# Altium project LimeSDR-X3_1v1.PrjPcb (part 13 of 19)

## Sheet 26_LMS3_RX2_BB_ADC.SchDoc: LMS3 RX2 BB ADC
size A3; Organization: Lime Microsystems; Address1: Surrey Tech Centre; Address2: Guildford GU2 7YG; Address3: Surrey; Address4: United Kingdom; Revision: v1.1; SheetNumber: 26; SheetTotal: 31
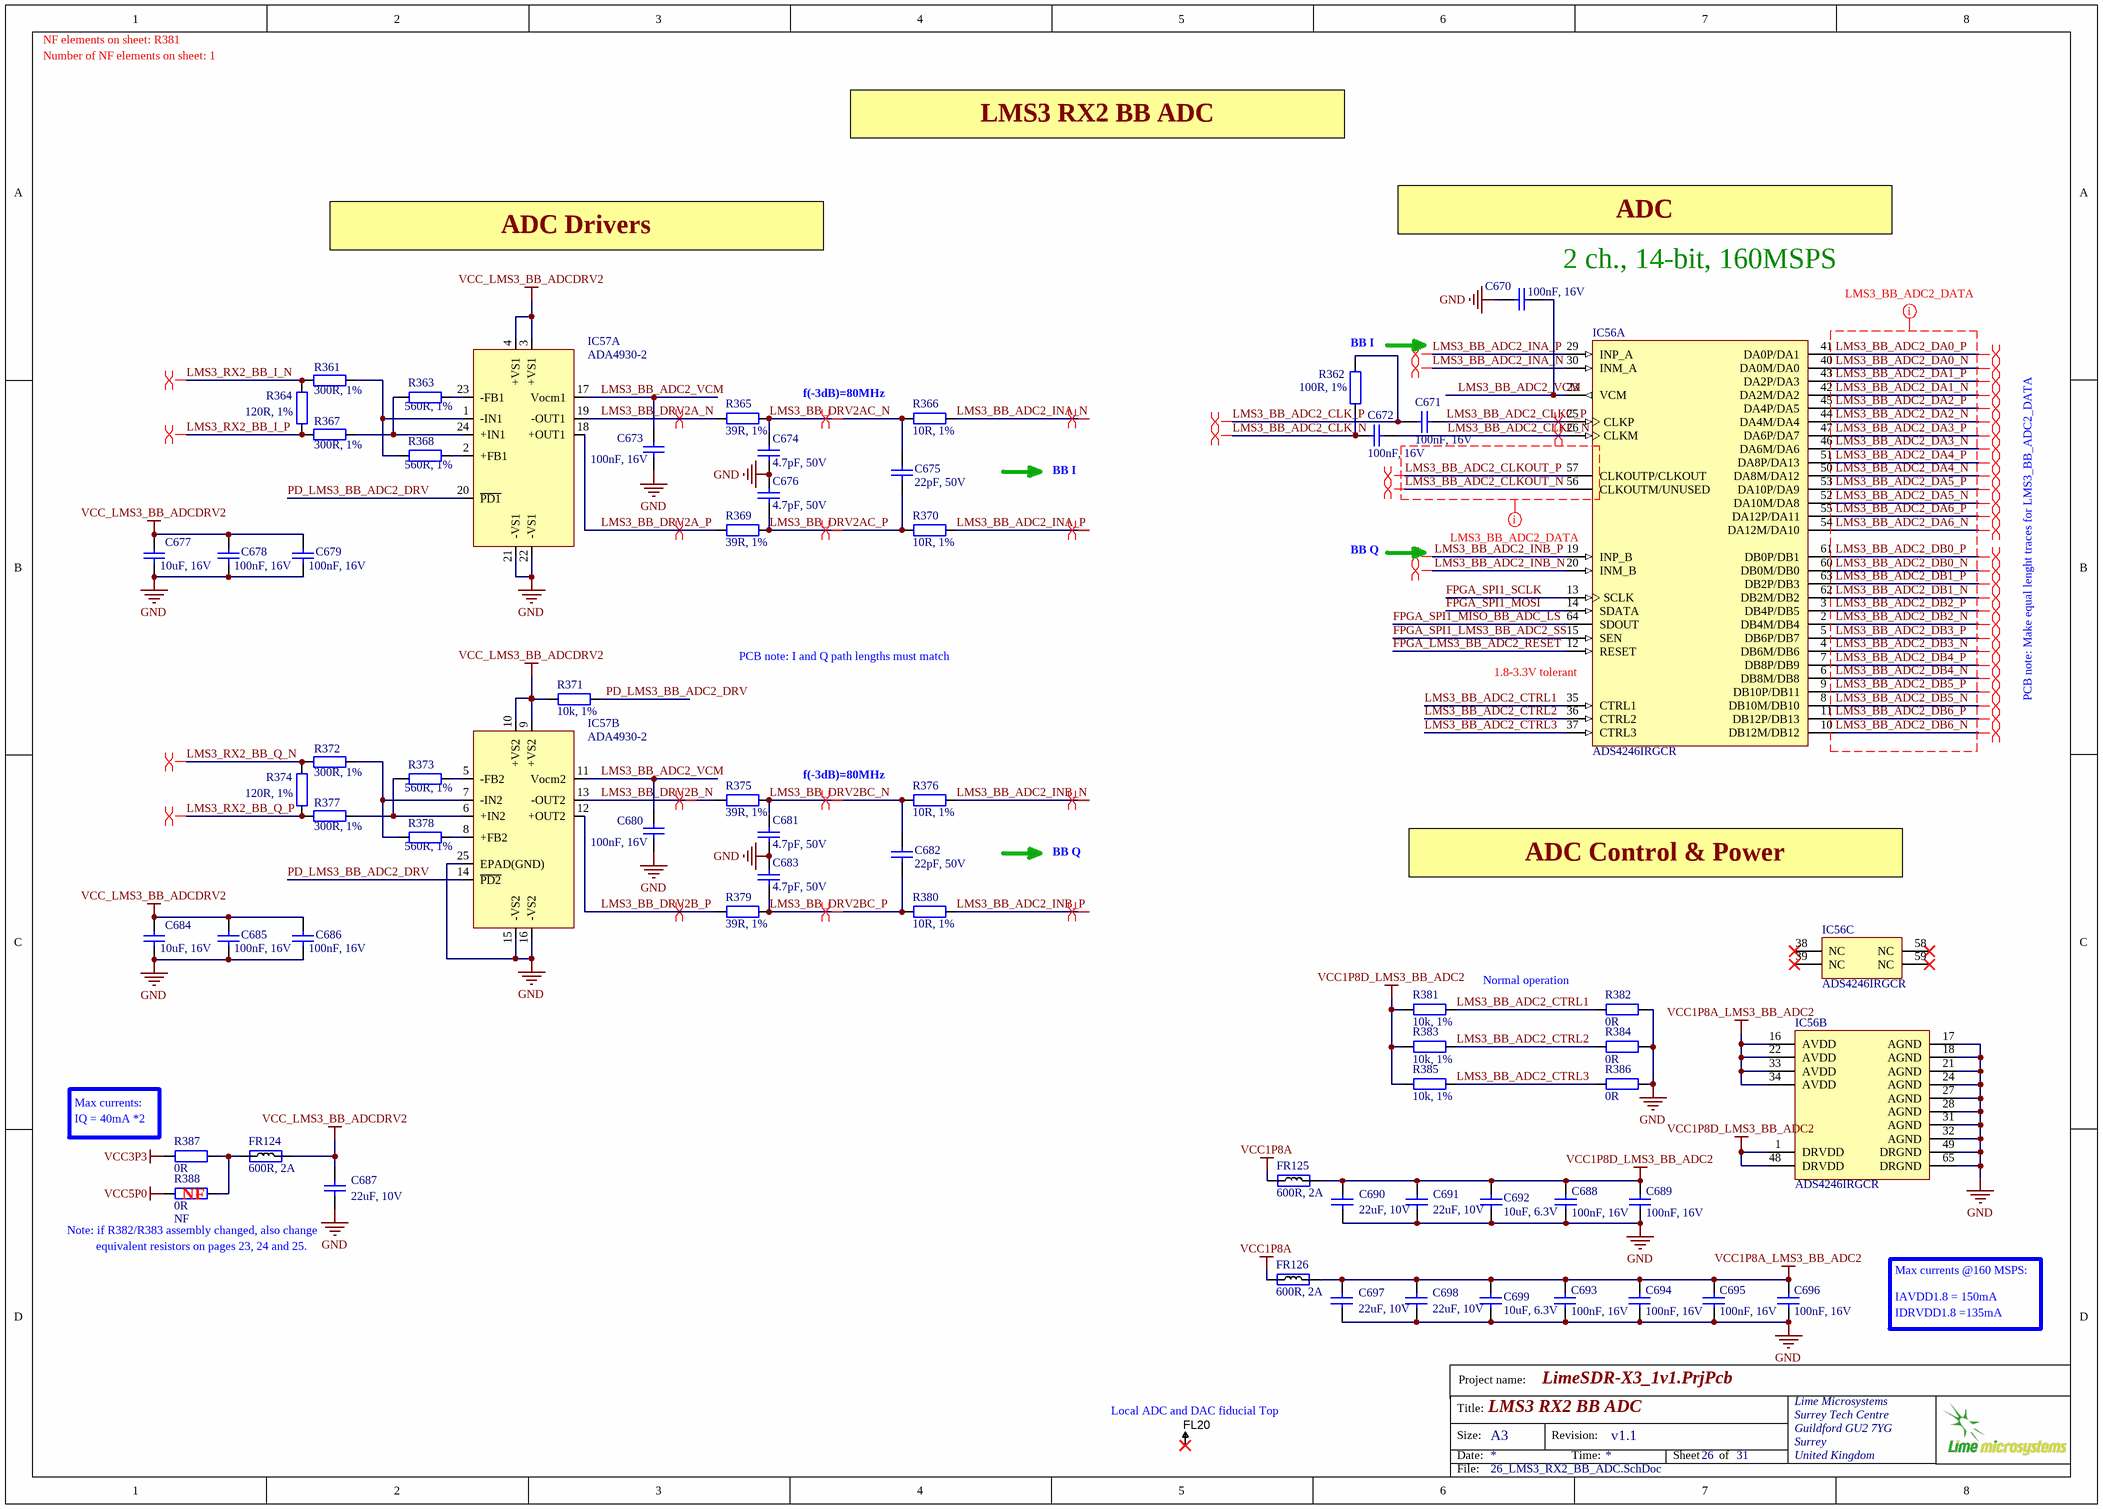
[diagram p25: 26_LMS3_RX2_BB_ADC.SchDoc]

### Parts
C670  100nF, 16V  [CAP0402]
C671  100nF, 16V  [CAP0402]
C672  100nF, 16V  [CAP0402]
C673  100nF, 16V  [CAP0402]
C674  4.7pF, 50V  [CAP0402]
C675  22pF, 50V  [CAP0402]
C676  4.7pF, 50V  [CAP0402]
C677  10uF, 16V  [CAP0603]
C678  100nF, 16V  [CAP0402]
C679  100nF, 16V  [CAP0402]
C680  100nF, 16V  [CAP0402]
C681  4.7pF, 50V  [CAP0402]
C682  22pF, 50V  [CAP0402]
C683  4.7pF, 50V  [CAP0402]
C684  10uF, 16V  [CAP0603]
C685  100nF, 16V  [CAP0402]
C686  100nF, 16V  [CAP0402]
C687  22uF, 10V  [CAP0603]
C688  100nF, 16V  [CAP0402]
C689  100nF, 16V  [CAP0402]
C690  22uF, 10V  [CAP0603]
C691  22uF, 10V  [CAP0603]
C692  10uF, 6.3V  [CAP0603]
C693  100nF, 16V  [CAP0402]
C694  100nF, 16V  [CAP0402]
C695  100nF, 16V  [CAP0402]
C696  100nF, 16V  [CAP0402]
C697  22uF, 10V  [CAP0603]
C698  22uF, 10V  [CAP0603]
C699  10uF, 6.3V  [CAP0603]
FL20  Fiducial  [Fiducial_local]  (value not drawn)
FR124  600R, 2A  [RES0805]
FR125  600R, 2A  [RES0805]
FR126  600R, 2A  [RES0805]
IC56  ADS4246IRGCR  [TI-RGC64-7400X7400TP_V]  (parts A,B,C of 3)
IC57  ADA4930-2  [ADA4930-2_LFCSP-24]  (parts A,B of 2)
R361  300R, 1%  [RES0402]
R362  100R, 1%  [RES0402]
R363  560R, 1%  [RES0402]
R364  120R, 1%  [RES0402]
R365  39R, 1%  [RES0402]
R366  10R, 1%  [RES0402]
R367  300R, 1%  [RES0402]
R368  560R, 1%  [RES0402]
R369  39R, 1%  [RES0402]
R370  10R, 1%  [RES0402]
R371  10k, 1%  [RES0402]
R372  300R, 1%  [RES0402]
R373  560R, 1%  [RES0402]
R374  120R, 1%  [RES0402]
R375  39R, 1%  [RES0402]
R376  10R, 1%  [RES0402]
R377  300R, 1%  [RES0402]
R378  560R, 1%  [RES0402]
R379  39R, 1%  [RES0402]
R380  10R, 1%  [RES0402]
R381  10k, 1%  [RES0402]
R382  0R  [RES0402]
R383  10k, 1%  [RES0402]
R384  0R  [RES0402]
R385  10k, 1%  [RES0402]
R386  0R  [RES0402]
R387  0R  [RES0402]
R388  0R  Assembly Info: NF  [RES0402]

### Nets
GND: C670.1 C673.2 C674.2 C676.1 C677.1 C678.2 C679.2 C680.2 C681.2 C683.1 C684.1 C685.2 C686.2 C687.1 C688.1 C689.1 C690.1 C691.1 C692.2 C693.1 C694.1 C695.1 C696.1 C697.1 C698.1 C699.2 IC56.17(AGND) IC56.18(AGND) IC56.21(AGND) IC56.24(AGND) IC56.27(AGND) IC56.28(AGND) IC56.31(AGND) IC56.32(AGND) IC56.49(DRGND) IC56.65(DRGND) IC57.15(-VS2) IC57.16(-VS2) IC57.21(-VS1) IC57.22(-VS1) IC57.25(EPAD(GND)) R382.1 R384.1 R386.1
VCC1P8A: FR125.1 FR126.1
VCC1P8A_LMS3_BB_ADC2: C693.2 C694.2 C695.2 C696.2 C697.2 C698.2 C699.1 FR126.2 IC56.16(AVDD) IC56.22(AVDD) IC56.33(AVDD) IC56.34(AVDD)
VCC1P8D_LMS3_BB_ADC2: C688.2 C689.2 C690.2 C691.2 C692.1 FR125.2 IC56.1(DRVDD) IC56.48(DRVDD) R381.2 R383.2 R385.2
VCC3P3: R387.2
VCC5P0: R388.2
VCC_LMS3_BB_ADCDRV2: C677.2 C678.1 C679.1 C684.2 C685.1 C686.1 C687.2 FR124.2 IC57.3(+VS1) IC57.4(+VS1) IC57.9(+VS2) IC57.10(+VS2) R371.2
FPGA_LMS3_BB_ADC2_RESET: IC56.12(RESET)
FPGA_SPI1_LMS3_BB_ADC2_SS: IC56.15(SEN)
FPGA_SPI1_MISO_BB_ADC_LS: IC56.64(SDOUT)
FPGA_SPI1_MOSI: IC56.14(SDATA)
FPGA_SPI1_SCLK: IC56.13(SCLK)
LMS3_BB_ADC2_CLK_N: C672.2 R362.1
LMS3_BB_ADC2_CLK_P: C671.2 R362.2
LMS3_BB_ADC2_CLKC_N: C672.1 IC56.26(CLKM)
LMS3_BB_ADC2_CLKC_P: C671.1 IC56.25(CLKP)
LMS3_BB_ADC2_CLKOUT_N: IC56.56(CLKOUTM/UNUSED)
LMS3_BB_ADC2_CLKOUT_P: IC56.57(CLKOUTP/CLKOUT)
LMS3_BB_ADC2_CTRL1: IC56.35(CTRL1) R381.1 R382.2
LMS3_BB_ADC2_CTRL2: IC56.36(CTRL2) R383.1 R384.2
LMS3_BB_ADC2_CTRL3: IC56.37(CTRL3) R385.1 R386.2
LMS3_BB_ADC2_DA0_N: IC56.40(DA0M/DA0)
LMS3_BB_ADC2_DA0_P: IC56.41(DA0P/DA1)
LMS3_BB_ADC2_DA1_N: IC56.42(DA2M/DA2)
LMS3_BB_ADC2_DA1_P: IC56.43(DA2P/DA3)
LMS3_BB_ADC2_DA2_N: IC56.44(DA4M/DA4)
LMS3_BB_ADC2_DA2_P: IC56.45(DA4P/DA5)
LMS3_BB_ADC2_DA3_N: IC56.46(DA6M/DA6)
LMS3_BB_ADC2_DA3_P: IC56.47(DA6P/DA7)
LMS3_BB_ADC2_DA4_N: IC56.50(DA8M/DA12)
LMS3_BB_ADC2_DA4_P: IC56.51(DA8P/DA13)
LMS3_BB_ADC2_DA5_N: IC56.52(DA10M/DA8)
LMS3_BB_ADC2_DA5_P: IC56.53(DA10P/DA9)
LMS3_BB_ADC2_DA6_N: IC56.54(DA12M/DA10)
LMS3_BB_ADC2_DA6_P: IC56.55(DA12P/DA11)
LMS3_BB_ADC2_DB0_N: IC56.60(DB0M/DB0)
LMS3_BB_ADC2_DB0_P: IC56.61(DB0P/DB1)
LMS3_BB_ADC2_DB1_N: IC56.62(DB2M/DB2)
LMS3_BB_ADC2_DB1_P: IC56.63(DB2P/DB3)
LMS3_BB_ADC2_DB2_N: IC56.2(DB4M/DB4)
LMS3_BB_ADC2_DB2_P: IC56.3(DB4P/DB5)
LMS3_BB_ADC2_DB3_N: IC56.4(DB6M/DB6)
LMS3_BB_ADC2_DB3_P: IC56.5(DB6P/DB7)
LMS3_BB_ADC2_DB4_N: IC56.6(DB8M/DB8)
LMS3_BB_ADC2_DB4_P: IC56.7(DB8P/DB9)
LMS3_BB_ADC2_DB5_N: IC56.8(DB10M/DB10)
LMS3_BB_ADC2_DB5_P: IC56.9(DB10P/DB11)
LMS3_BB_ADC2_DB6_N: IC56.10(DB12M/DB12)
LMS3_BB_ADC2_DB6_P: IC56.11(DB12P/DB13)
LMS3_BB_ADC2_INA_N: IC56.30(INM_A) R366.1
LMS3_BB_ADC2_INA_P: IC56.29(INP_A) R370.1
LMS3_BB_ADC2_INB_N: IC56.20(INM_B) R376.1
LMS3_BB_ADC2_INB_P: IC56.19(INP_B) R380.1
LMS3_BB_ADC2_VCM: C670.2 C673.1 C680.1 IC56.23(VCM) IC57.11(Vocm2) IC57.17(Vocm1)
LMS3_BB_DRV2A_N: IC57.19(-OUT1) R365.2
LMS3_BB_DRV2A_P: IC57.18(+OUT1) R369.2
LMS3_BB_DRV2AC_N: C674.1 C675.1 R365.1 R366.2
LMS3_BB_DRV2AC_P: C675.2 C676.2 R369.1 R370.2
LMS3_BB_DRV2B_N: IC57.13(-OUT2) R375.2
LMS3_BB_DRV2B_P: IC57.12(+OUT2) R379.2
LMS3_BB_DRV2BC_N: C681.1 C682.1 R375.1 R376.2
LMS3_BB_DRV2BC_P: C682.2 C683.2 R379.1 R380.2
LMS3_RX2_BB_I_N: R361.2 R364.2
LMS3_RX2_BB_I_P: R364.1 R367.2
LMS3_RX2_BB_Q_N: R372.2 R374.2
LMS3_RX2_BB_Q_P: R374.1 R377.2
PD_LMS3_BB_ADC2_DRV: IC57.14(~{PD2}) IC57.20(~{PD1}) R371.1
NetFR124_1: FR124.1 R387.1 R388.1
NetIC57_1: IC57.1(-IN1) R361.1 R368.2
NetIC57_2: IC57.2(+FB1) R368.1
NetIC57_5: IC57.5(-FB2) R373.1
NetIC57_6: IC57.6(+IN2) R373.2 R377.1
NetIC57_7: IC57.7(-IN2) R372.1 R378.2
NetIC57_8: IC57.8(+FB2) R378.1
NetIC57_23: IC57.23(-FB1) R363.1
NetIC57_24: IC57.24(+IN1) R363.2 R367.1

Not connected (* = marked no-connect by the designer): FL20 1*; IC56 38(NC)* 39(NC)* 58(NC)* 59(NC)*

### Layout directives
net class LMS3_BB_ADC2_DATA: LMS3_BB_ADC2_CLKOUT_N, LMS3_BB_ADC2_CLKOUT_P, LMS3_BB_ADC2_DA0_N, LMS3_BB_ADC2_DA0_P, LMS3_BB_ADC2_DA1_N, LMS3_BB_ADC2_DA1_P, LMS3_BB_ADC2_DA2_N, LMS3_BB_ADC2_DA2_P, LMS3_BB_ADC2_DA3_N, LMS3_BB_ADC2_DA3_P, LMS3_BB_ADC2_DA4_N, LMS3_BB_ADC2_DA4_P, LMS3_BB_ADC2_DA5_N, LMS3_BB_ADC2_DA5_P, LMS3_BB_ADC2_DA6_N, LMS3_BB_ADC2_DA6_P, LMS3_BB_ADC2_DB0_N, LMS3_BB_ADC2_DB0_P, LMS3_BB_ADC2_DB1_N, LMS3_BB_ADC2_DB1_P, LMS3_BB_ADC2_DB2_N, LMS3_BB_ADC2_DB2_P, LMS3_BB_ADC2_DB3_N, LMS3_BB_ADC2_DB3_P, LMS3_BB_ADC2_DB4_N, LMS3_BB_ADC2_DB4_P, LMS3_BB_ADC2_DB5_N, LMS3_BB_ADC2_DB5_P, LMS3_BB_ADC2_DB6_N, LMS3_BB_ADC2_DB6_P
differential pair: LMS3_BB_ADC2_CLK_N, LMS3_BB_ADC2_CLK_P, LMS3_BB_ADC2_CLKC_N, LMS3_BB_ADC2_CLKC_P, LMS3_BB_ADC2_CLKOUT_N, LMS3_BB_ADC2_CLKOUT_P, LMS3_BB_ADC2_DA0_N, LMS3_BB_ADC2_DA0_P, LMS3_BB_ADC2_DA1_N, LMS3_BB_ADC2_DA1_P, LMS3_BB_ADC2_DA2_N, LMS3_BB_ADC2_DA2_P, LMS3_BB_ADC2_DA3_N, LMS3_BB_ADC2_DA3_P, LMS3_BB_ADC2_DA4_N, LMS3_BB_ADC2_DA4_P, LMS3_BB_ADC2_DA5_N, LMS3_BB_ADC2_DA5_P, LMS3_BB_ADC2_DA6_N, LMS3_BB_ADC2_DA6_P, LMS3_BB_ADC2_DB0_N, LMS3_BB_ADC2_DB0_P, LMS3_BB_ADC2_DB1_N, LMS3_BB_ADC2_DB1_P, LMS3_BB_ADC2_DB2_N, LMS3_BB_ADC2_DB2_P, LMS3_BB_ADC2_DB3_N, LMS3_BB_ADC2_DB3_P, LMS3_BB_ADC2_DB4_N, LMS3_BB_ADC2_DB4_P, LMS3_BB_ADC2_DB5_N, LMS3_BB_ADC2_DB5_P, LMS3_BB_ADC2_DB6_N, LMS3_BB_ADC2_DB6_P, LMS3_BB_ADC2_INA_N, LMS3_BB_ADC2_INA_P, LMS3_BB_ADC2_INB_N, LMS3_BB_ADC2_INB_P, LMS3_BB_DRV2A_N, LMS3_BB_DRV2A_P, LMS3_BB_DRV2AC_N, LMS3_BB_DRV2AC_P, LMS3_BB_DRV2B_N, LMS3_BB_DRV2B_P, LMS3_BB_DRV2BC_N, LMS3_BB_DRV2BC_P, LMS3_RX2_BB_I_N, LMS3_RX2_BB_I_P, LMS3_RX2_BB_Q_N, LMS3_RX2_BB_Q_P

### Notes on the sheet
- NF elements on sheet: R381
- Number of NF elements on sheet: 1
- LMS3 RX2 BB ADC
- ADC Drivers
- ADC
- (near C670) 2 ch., 14-bit, 160MSPS
- (near R362) BB I
- f(-3dB)=80MHz
- BB I
- BB Q
- PCB note: I and Q path lengths must match
- (near IC56) 1.8-3.3V tolerant
- PCB note: Make equal lenght traces for LMS3_BB_ADC2_DATA
- ADC Control & Power
- Normal operation
- (near R387) IQ = 40mA *2
- (near R387) Max currents:
- Note: if R382/R383 assembly changed, also change
- equivalent resistors on pages 23, 24 and 25.
- (near R388) NF
- IAVDD1.8 = 150mA
- IDRVDD1.8 =135mA
- Max currents @160 MSPS:
- (near FL20) Local ADC and DAC fiducial Top
- Project name:
- Title:
- Size:
- Date:
- A3
- Revision:
- Time:
- Sheet
- of
- File:

### Library data of the parts
C670-C673 C680 C688 C689 C693-C696 = Cap_0603: Part Description: 0.10µF ±10% 16V X7R Ceramic Capacitor -55°C ~ 125°C Surface Mount, MLCC 0402 (1005 Metric) 0.039" L x 0.020" W (1.00mm x 0.50mm); Manufacturer Part Number 1: GRM155R71C104KA88D; Brand: Murata Electronics; Tolerance: 10 %; Type: General Purpose MLCC; Capacitance: 0.1 uF; Temperature Coefficient / Code: +/- 15 %; Case Height: 0.5 mm; Case Length: 1 mm; Dielectric: X7R; Supplier 1: Mouser; Supplier Part Number 1: 81-GRM155R71C104KA88; Case Code - in: 0402; Manufacturer: Murata Electronics; Category: Multilayer Ceramic Capacitors MLCC - SMD/SMT; Voltage Rating DC: 16 V; Value: 100nF, 16V; Case Code - mm: 1005; Case Width: 0.5 mm; Maximum Operating Temperature: + 125 C; Minimum Operating Temperature: - 55 C; Minimum Order Quantity: 1; Operating Temperature Range: - 55 C to + 125 C; Package / Case: 0402 (1005 metric); Packaging: Reel; Product: General Type MLCCs; Product Category: Low & Medium Capacitance SMD Ceramic Chip Capacitors; Reeling: True; RoHS - Mouser: Y; RoHS: RoHS Compliant; Series: GRM; Standard Pack Qty: 10000; Termination Style: SMD/SMT
C674 C676 C681 C683 = Cap_0402: Manufacturer: MURATA; Manufacturer Part Number 1: GRM1555C1H4R7CA01D; Part Description: 4.7pF ±0.25pF 50V Ceramic Capacitor C0G, NP0 0402 (1005 Metric); Capacitance Tolerance: ± 0.25; Voltage Rating: 50; Dielectric Characteristic: C0G / NP0; Ceramic Capacitor Case: 0402 [1005 Metric]; Capacitance: 4.7; SVHC: No SVHC (15-Jun-2015; Product Range: GRM Series; Value: 4.7pF, 50V; Supplier 1: Farnell; Supplier Part Number 1: 2434644; Operating Temperature Max: 125; Operating Temperature Min: -55; MSL: MSL 1 - Unlimited; RoHS: YES; Packaging: Cut Tape
C675 C682 = Cap_0402: Manufacturer: Yageo; Manufacturer Part Number 1: CC0402JRNPO9BN220; Part Description: 22pF ±5% 50V C0G, NP0 Ceramic Capacitor -55°C ~ 125°C Surface Mount, MLCC 0402 (1005 Metric) 0.039" L x 0.020" W (1.00mm x 0.50mm); Tolerance: ±5%; Temperature Coefficient: C0G, NP0; Value: 22pF, 50V; Supplier 1: Digi-Key; Supplier Part Number 1: 311-1018-2-ND; Category: Capacitors; Voltage - Rated: 50V; Packaging: Tape & Reel (TR); RoHS: RoHS Compliant; Capacitance: 22pF; Operating Temperature: -55°C ~ 125°C; Mounting Type: Surface Mount, MLCC; Height - Seated (Max): -; Size / Dimension: 0.039" L x 0.020" W (1.00mm x 0.50mm); Ratings: -; Applications: General Purpose; Thickness (Max): 0.022" (0.55mm); Lead Spacing: -; Lead Style: -; Features: -; Package / Case: 0402 (1005 Metric)
C677 C684 = Cap_0603: Manufacturer: Yageo; Manufacturer Part Number 1: GRM188R61C106MA73D; Part Description: 10µF ±20% 16V Ceramic Capacitor X5R 0603 (1608 Metric); Temperature Coefficient: X5R; Capacitance: 10µF; Tolerance: ±20%; Value: 10uF, 16V; Supplier 1: Digi-Key; Supplier Part Number 1: 490-7201-2-ND; Category: Capacitors; Ratings: -; Features: -; Lead Style: -; Package / Case: 0603 (1608 Metric); Lead Spacing: -; Applications: General Purpose; Voltage - Rated: 16V; Operating Temperature: -55°C ~ 85°C; Thickness (Max): 0.039" (1.00mm); Mounting Type: Surface Mount, MLCC; RoHS: RoHS Compliant; Size / Dimension: 0.063" L x 0.031" W (1.60mm x 0.80mm); Packaging: Tape & Reel (TR); Height - Seated (Max): -
C678 C679 C685 C686 = Cap_0603: Manufacturer Part Number 1: GRM155R71C104KA88D; Part Description: 0.10µF ±10% 16V X7R Ceramic Capacitor -55°C ~ 125°C Surface Mount, MLCC 0402 (1005 Metric) 0.039" L x 0.020" W (1.00mm x 0.50mm); Brand: Murata Electronics; Tolerance: 10 %; Type: General Purpose MLCC; Capacitance: 0.1 uF; Temperature Coefficient / Code: +/- 15 %; Case Height: 0.5 mm; Case Length: 1 mm; Dielectric: X7R; Supplier 1: Mouser; Supplier Part Number 1: 81-GRM155R71C104KA88; Case Code - in: 0402; Manufacturer: Murata Electronics; Category: Multilayer Ceramic Capacitors MLCC - SMD/SMT; Voltage Rating DC: 16 V; Value: 100nF, 16V; Case Code - mm: 1005; Case Width: 0.5 mm; Maximum Operating Temperature: + 125 C; Minimum Operating Temperature: - 55 C; Minimum Order Quantity: 1; Operating Temperature Range: - 55 C to + 125 C; Package / Case: 0402 (1005 metric); Packaging: Reel; Product: General Type MLCCs; Product Category: Low & Medium Capacitance SMD Ceramic Chip Capacitors; Reeling: True; RoHS - Mouser: Y; RoHS: RoHS Compliant; Series: GRM; Standard Pack Qty: 10000; Termination Style: SMD/SMT
C687 C690 C691 C697 C698 = Cap_0603: Manufacturer Part Number 1: C1608X5R1A226M080AC; Part Description: 22µF ±20% 10V Ceramic Capacitor X5R 0603 (1608 Metric); Manufacturer: TDK Corporation; Brand: TDK; Temperature Coefficient / Code: +/- 15 %; Tolerance: 20 %; Type: Multilayer Ceramic Chip Capacitor; Supplier 1: Mouser; Supplier Part Number 1: 810-C1608X5R1A226M; Package / Case: 0603 (1608 metric); Category: Multilayer Ceramic Capacitors MLCC - SMD/SMT; Capacitance: 22uF; Operating Temperature Range: - 55 C to + 85 C; Case Code - in: 0603; Voltage Rating DC: 10 V; Case Code - mm: 1608; Value: 22uF, 10V
C692 C699 = Cap_0603: Manufacturer Part Number 1: CC0603MRX5R5BB106; Part Description: 10µF ±20% 6.3V X5R Ceramic Capacitor -55°C ~ 85°C Surface Mount, MLCC 0603 (1608 Metric) 0.063" L x 0.031" W (1.60mm x 0.80mm); Manufacturer: Yageo; Capacitance: 10µF; Tolerance: ±20%; Supplier 1: Digi-Key; Supplier Part Number 1: 311-1448-2-ND; Package / Case: 0603 (1608 Metric); Category: Capacitors; Voltage - Rated: 6.3V; Value: 10uF, 6.3V
FR124 = Ferrite: Manufacturer Part Number 1: MPZ2012S601AT000; Manufacturer: TDK Corporation; Part Description: FERRITE BEAD 600 OHM 0805 1LN; Filter Type: Differential Mode - Single; Impedance @ Frequency: 600 Ohm @ 100MHz; DC Resistance (DCR): 100 mOhm Max; Supplier 1: Digi-Key; Supplier Part Number 1: 445-2206-2-ND; Mounting Type: Surface Mount; RoHS: RoHS Compliant; Height (Max): 0.041" (1.05mm); Packaging: Tape & Reel (TR); Category: Filters; Current Rating: 2A; Package / Case: 0805 (2012 Metric); Size / Dimension: 0.079" L x 0.049" W (2.00mm x 1.25mm); Value: 600R, 2A
FR125 FR126 = Ferrite: Manufacturer Part Number 1: MPZ2012S601AT000; Manufacturer: TDK Corporation; Part Description: FERRITE BEAD 600 OHM 0805 1LN; DC Resistance (DCR): 100 mOhm Max; Filter Type: Differential Mode - Single; Impedance @ Frequency: 600 Ohm @ 100MHz; Supplier 1: Digi-Key; Supplier Part Number 1: 445-2206-2-ND; Value: 600R, 2A; Category: Filters; Current Rating: 2A; Height (Max): 0.041" (1.05mm); Mounting Type: Surface Mount; Package / Case: 0805 (2012 Metric); Packaging: Tape & Reel (TR); RoHS: RoHS Compliant; Size / Dimension: 0.079" L x 0.049" W (2.00mm x 1.25mm)
IC56 = ADS4246IRGCR: 14-Bit 160 MSPS Dual Low Power ADC, -40 to 85 degC, 64-pin QFN (RGC64), Green (RoHS & no Sb/Br); Manufacturer: Texas Instruments; Manufacturer Part Number 1: ADS4246IRGCT; Part Description: 14 Bit Analog to Digital Converter 2 Input 2 Pipelined 64-VQFN (9x9); Number of Bits: 14; Sampling Rate (Per Second): 160M; Number of Inputs: 2; Input Type: Differential; Data Interface: LVDS - Parallel, Parallel; Configuration: S/H-ADC; Ratio - S/H:ADC: 1:1; Architecture: Pipelined; Reference Type: Internal; Voltage - Supply, Analog: 1.7 V ~ 1.9 V; Supplier 1: Digi-Key; Supplier Part Number 1: 296-28772-1-ND; RoHS: RoHS Compliant; Category: Integrated Circuits (ICs); Stock 1: 83; Pricing 1: 1=95.91, 10=90.96, 100=82.2967 (USD); Packaging: Cut Tape (CT); Part Status: Active; Number of A/D Converters: 2; Voltage - Supply, Digital: 1.7 V ~ 1.9 V; Features: Simultaneous Sampling; Operating Temperature: -40°C ~ 85°C; Package / Case: 64-VFQFN Exposed Pad; Supplier Device Package: 64-VQFN (9x9); ComponentLink1URL: http://www.ti.com/lit/ds/symlink/ads4246.pdf; ComponentLink1Description: http://www.ti.com/lit/ds/symlink/ads4246.pdf
IC57 = ADA4930-2: Manufacturer: Analog Devices Inc.; Manufacturer Part Number 1: ADA4930-2YCPZ-R7; Part Description: Differential Amplifier 2 Circuit Differential 24-LFCSP-WQ (4x4); Amplifier Type: Differential; Voltage - Supply, Single/Dual (±): 3.3V, 5V; Number of Circuits: 2; Current - Supply: 34mA; Slew Rate: 3400 V/µs; Voltage - Input Offset: 150µV; Current - Input Bias: 23µA; -3db Bandwidth: 1.35GHz; Current - Output / Channel: 30mA; Supplier 1: Digi-Key; Mounting Type: Surface Mount; Gain Bandwidth Product: -; Supplier Device Package: 24-LFCSP-VQ (4x4); Category: Integrated Circuits (ICs); Operating Temperature: -40°C ~ 105°C; Packaging: Cut Tape (CT); RoHS: RoHS Compliant; Package / Case: 24-VFQFN Exposed Pad, CSP; Output Type: Differential; Supplier Part Number 1: ADA4930-2YCPZ-R7CT-ND
R361 R367 R372 R377 = Res_0402: Manufacturer: Vishay Dale; Part Description: RES SMD 300 OHM 1% 1/16W 0402; Manufacturer Part Number 1: CRCW0402300RFKED; Resistance (Ohms): 300; Temperature Coefficient: ±100ppm/°C; Power (Watts): 0.063W, 1/16W; Value: 300R, 1%; Supplier 1: Digi-Key; Supplier Device Package: 0402 (1005 Metric); Composition: Thick Film; Features: Automotive AEC-Q200; Packaging: Cut Tape (CT); Size / Dimension: 0.039" L x 0.020" W (1.00mm x 0.50mm); Category: Resistors; Package / Case: 0402 (1005 Metric); Supplier Part Number 1: 541-300LCT-ND; Number of Terminations: 2; Tolerance: ±1%; Height: 0.016" (0.40mm); Operating Temperature: -55°C ~ 155°C; RoHS: RoHS Compliant
R362 = Res_0402: Manufacturer Part Number 1: RMCF0402FT100R; Part Description: RES SMD 100 OHM 1% 1/16W 0402; Manufacturer: Stackpole Electronics Inc.; Temperature Coefficient: ±100ppm/°C; Supplier 1: Digi-Key; Supplier Part Number 1: RMCF0402FT100RDKR-ND; Package / Case: 0402 (1005 Metric); Composition: Thick Film; Category: Resistors; Tolerance: ±1%; Value: 100R, 1%
R363 R368 R373 R378 = Res_0402: Manufacturer: Vishay Dale; Part Description: RES SMD 560 OHM 1% 1/16W 0402; Manufacturer Part Number 1: CRCW0402560RFKED; Resistance (Ohms): 560; Temperature Coefficient: ±100ppm/°C; Power (Watts): 0.063W, 1/16W; Value: 560R, 1%; Supplier Device Package: 0402 (1005 Metric); Composition: Thick Film; Packaging: Cut Tape (CT); Number of Terminations: 2; Operating Temperature: -55°C ~ 155°C; Supplier Part Number 1: 541-560LCT-ND; Supplier 1: Digi-Key; Category: Resistors; Height: 0.016" (0.40mm); Features: Automotive AEC-Q200; Size / Dimension: 0.039" L x 0.020" W (1.00mm x 0.50mm); Tolerance: ±1%; Package / Case: 0402 (1005 Metric); RoHS: RoHS Compliant
R364 R374 = Res_0402: Manufacturer: Yageo; Manufacturer Part Number 1: RC0402FR-07120RL; Part Description: 120 Ohms ±1% 0.063W, 1/16W Chip Resistor 0402 (1005 Metric) Moisture Resistant Thick Film; Power Rating: 62.5mW; Voltage Rating: 50V; Temperature Coefficient: 100ppm/°C; Max Power Dissipation: 63mW; Value: 120R, 1%; Supplier 1: Digi-Key; Supplier Part Number 1: 311-120LRCT-ND; Stock 1: 1593308; Pricing 1: 1=0.1, 10=0.016, 100=0.0067, 1000=0.00301, 2500=0.00261, 5000=0.00215 (USD); Case/Package: 0402; Case Code (Imperial): 0402; Case Code (Metric): 1005; Min Operating Temperature: -55°C; Max Operating Temperature: 155°C; Package Quantity: 1; Resistance: 120R; Tolerance: 1%; Packaging: Tape and Reel; Termination: SMD/SMT; Composition: Thick Film; Number of Terminations: 2; Military Standard: Not; Features: Moisture Resistant; Length: 1mm; Height: 0.016inch; Width: 0.02inch; Depth: 0.5mm; REACH SVHC: No SVHC; Lead Free: Lead Free; ComponentLink1URL: http://www.farnell.com/datasheets/1018594.pdf?src-supplier=Element14; ComponentLink1Description: http://www.farnell.com/datasheets/1018594.pdf?src-supplier=Element14; ComponentLink2URL: http://www.mouser.com/ds/2/447/PYu-RC0402_51_RoHS_L_6_r-8721.pdf?src-supplier=Mouser; ComponentLink2Description: http://www.mouser.com/ds/2/447/PYu-RC0402_51_RoHS_L_6_r-8721.pdf?src-supplier=Mouser; ComponentLink3URL: http://documents.rs-components.com/techlib://itc_doclist_GB.htm?stockno=6185898&src-supplier=RSComponents; ComponentLink3Description: http://documents.rs-components.com/techlib://itc_doclist_GB.htm?stockno=6185898&src-supplier=RSComponents; ComponentLink4URL: http://www.yageo.com/documents/recent/PYu-RC_Group_51_RoHS_L_10.pdf?src-supplier=Digi-Key; ComponentLink4Description: http://www.yageo.com/documents/recent/PYu-RC_Group_51_RoHS_L_10.pdf?src-supplier=Digi-Key; ComponentLink5URL: http://www.yageo.com/documents/recent/PYu-RC0402_51_RoHS_L_6_r.pdf?src-supplier=Future+Electronics; ComponentLink5Description: http://www.yageo.com/documents/recent/PYu-RC0402_51_RoHS_L_6_r.pdf?src-supplier=Future+Electronics
R365 R369 R375 R379 = Res_0402: Manufacturer: Yageo; Manufacturer Part Number 1: RC0402FR-0739RL; Part Description: 39 Ohms ±1% 0.063W, 1/16W Chip Resistor 0402 (1005 Metric) Moisture Resistant Thick Film; Power Rating: 63mW; Voltage Rating: 50V; Temperature Coefficient: 100ppm/°C; Value: 39R, 1%; ComponentLink1URL: http://www.yageo.com.tw/exep/pages/download/literatures/PYu-R_INT-thick_7.pdf?src-supplier=Digi-Key; ComponentLink1Description: http://www.yageo.com.tw/exep/pages/download/literatures/PYu-R_INT-thick_7.pdf?src-supplier=Digi-Key; ComponentLink2URL: http://www.yageo.com/NewPortal/yageodocoutput?fileName=/pdf/R-Chip/PYu-RC_51_RoHS_P_0.pdf&src-supplier=Digi-Key; ComponentLink2Description: http://www.yageo.com/NewPortal/yageodocoutput?fileName=/pdf/R-Chip/PYu-RC_51_RoHS_P_0.pdf&src-supplier=Digi-Key; Supplier 1: Digi-Key; Supplier Part Number 1: 311-39.0LRCT-ND; Stock 1: 1060646; Pricing 1: 1=0,10000, 10=0,01600, 100=0,00660, 1000=0,00299, 2500=0,00259, 5000=0,00214 (USD); RoHS: Yes; Case/Package: 0402; Case Code (Imperial): 0402; Case Code (Metric): 1005; Weight: 2.3E-05oz; Contact Plating: Tin,Matte; Min Operating Temperature: -55°C; Max Operating Temperature: 155°C; Tolerance: 1%; Package Quantity: 1; Packaging: Tape and Reel; Features: Moisture Resistant; Resistance: 39R; Termination: SMD/SMT; Resistor Type: Thick Film; Number of Terminations: 2; Max Power Dissipation: 63mW; Working Voltage: 50V; Series: RC; Resistance Tolerance: 1%; Construction: Rectangular; Technology: THICK FILM; Length: 1mm; Width: 0.5mm; Height: 0.016inch; Depth: 0.5mm; Radiation Hardening: No; Lead Free: Lead Free; REACH SVHC: Unknown; Military Standard: Not; RoHS Compliant: Yes; ComponentLink3URL: https://datasheet.ciiva.com/11819/0900766b80c66297-11819479.pdf?src-supplier=RSComponents; ComponentLink3Description: https://datasheet.ciiva.com/11819/0900766b80c66297-11819479.pdf?src-supplier=RSComponents; ComponentLink4URL: https://datasheet.ciiva.com/2519/pyu-r-int-thick-7-2519001.pdf?src-supplier=Digi-Key; ComponentLink4Description: https://datasheet.ciiva.com/2519/pyu-r-int-thick-7-2519001.pdf?src-supplier=Digi-Key; ComponentLink5URL: https://datasheet.ciiva.com/2519/pyu-r-int-thick-7-2519002.pdf?src-supplier=Digi-Key; ComponentLink5Description: https://datasheet.ciiva.com/2519/pyu-r-int-thick-7-2519002.pdf?src-supplier=Digi-Key; ComponentLink6URL: https://datasheet.ciiva.com/2519/pyu-r-int-thick-7-2519000.pdf?src-supplier=Digi-Key; ComponentLink6Description: https://datasheet.ciiva.com/2519/pyu-r-int-thick-7-2519000.pdf?src-supplier=Digi-Key; ComponentLink7URL: https://datasheet.ciiva.com/7849/1018594-7849983.pdf?src-supplier=Element14; ComponentLink7Description: https://datasheet.ciiva.com/7849/1018594-7849983.pdf?src-supplier=Element14; ComponentLink8URL: https://datasheet.ciiva.com/7849/1018594-7849982.pdf?src-supplier=Element14; ComponentLink8Description: https://datasheet.ciiva.com/7849/1018594-7849982.pdf?src-supplier=Element14; ComponentLink9URL: https://datasheet.ciiva.com/8889/pyu-rc0402-51-rohs-l-6-8889306.pdf?src-supplier=Avnet; ComponentLink9Description: https://datasheet.ciiva.com/8889/pyu-rc0402-51-rohs-l-6-8889306.pdf?src-supplier=Avnet; ComponentLink10URL: https://datasheet.ciiva.com/16741/pyu-rc0402-51-rohs-l-6-r-16741016.pdf?src-supplier=Future+Electronics; ComponentLink10Description: https://datasheet.ciiva.com/16741/pyu-rc0402-51-rohs-l-6-r-16741016.pdf?src-supplier=Future+Electronics; ComponentLink11URL: https://datasheet.ciiva.com/15189/getdatasheetpartid-325130-15189445.pdf?src-supplier=Verical; ComponentLink11Description: https://datasheet.ciiva.com/15189/getdatasheetpartid-325130-15189445.pdf?src-supplier=Verical
R366 R370 R376 R380 = Res_0402: Manufacturer 1: Yageo; Manufacturer Part Number 1: RC0402FR-0710RP; Part Description: 10 Ohms ±1% 0.063W, 1/16W Chip Resistor 0402 (1005 Metric) - Thick Film; Temperature Coefficient: 350ppm/°C; Max Power Dissipation: 63mW; Value: 10R, 1%; Supplier 1: Digi-Key; Supplier Part Number 1: YAG1250CT-ND; Stock 1: 35341; Pricing 1: 1=0,10000, 10=0,04200, 100=0,01700, 1000=0,00765, 2500=0,00664, 5000=0,00548 (USD); RoHS: Yes; Case/Package: 0402; Case Code (Metric): 1005; Case Code (Imperial): 0402; Min Operating Temperature: -55°C; Max Operating Temperature: 155°C; Packaging: Tape and Reel; Resistance: 10R; Resistor Type: Thick Film; Number of Terminations: 2; Tolerance: 1%; Features: Moisture Resistant; Length: 0.039inch; Width: 0.02inch; Height: 0.016inch; RoHS Compliant: Yes; ComponentLink1URL: http://www.yageo.com.tw/exep/pages/download/literatures/PYu-R_INT-thick_7.pdf?src-supplier=Digi-Key; ComponentLink1Description: http://www.yageo.com.tw/exep/pages/download/literatures/PYu-R_INT-thick_7.pdf?src-supplier=Digi-Key; ComponentLink2URL: http://www.yageo.com/NewPortal/yageodocoutput?fileName=/pdf/R-Chip/PYu-RC_51_RoHS_P_0.pdf&src-supplier=Digi-Key; ComponentLink2Description: http://www.yageo.com/NewPortal/yageodocoutput?fileName=/pdf/R-Chip/PYu-RC_51_RoHS_P_0.pdf&src-supplier=Digi-Key
R371 R381 R383 R385 = Res_0402: Manufacturer: Yageo; Manufacturer Part Number 1: RC0402FR-0710KL; Part Description: RES SMD 10K OHM 1% 1/16W 0402; Temperature Coefficient: ±100ppm/°C; Power (Watts): 0.063W, 1/16W; Value: 10k, 1%; Supplier 1: Digi-Key; Supplier Part Number 1: 311-10.0KLRTR-ND; Resistance (Ohms): 10k; Packaging: Tape & Reel (TR); RoHS: RoHS Compliant; Package / Case: 0402 (1005 Metric); Tolerance: ±1%; Operating Temperature: -55°C ~ 155°C; Size / Dimension: 0.039" L x 0.020" W (1.00mm x 0.50mm); Number of Terminations: 2; Category: Resistors; Height: 0.016" (0.40mm); Supplier Device Package: 0402; Features: Moisture Resistant; Composition: Thick Film
R382 R384 R386 = Res_0402: Manufacturer: Yageo; Part Description: RES SMD 0.0OHM JUMPER 1/16W 0402; Manufacturer Part Number 1: RC0402JR-070RL; Supplier 1: Digi-Key; Supplier Part Number 1: 311-0.0JRTR-ND; Composition: Thick Film; Package / Case: 0402 (1005 Metric); Category: Resistors; Value: 0R
R387 R388 = Res_0402: Manufacturer Part Number 1: RC0402JR-070RL; Manufacturer: Yageo; Part Description: RES SMD 0.0OHM JUMPER 1/16W 0402; Resistance (Ohms): 0.0; Tolerance: Jumper; Power (Watts): 0.063W, 1/16W; Value: 0R; Supplier 1: Digi-Key; Supplier Part Number 1: 311-0.0JRTR-ND; Category: Resistors; Temperature Coefficient: -; Features: Moisture Resistant; Supplier Device Package: 0402; Height: 0.016" (0.40mm); Package / Case: 0402 (1005 Metric); Operating Temperature: -55°C ~ 155°C; Size / Dimension: 0.039" L x 0.020" W (1.00mm x 0.50mm); Composition: Thick Film; Packaging: Tape & Reel (TR); Number of Terminations: 2; RoHS: RoHS Compliant